# EAGLE design Qwiic Joystick (EAGLE 9.1.0)
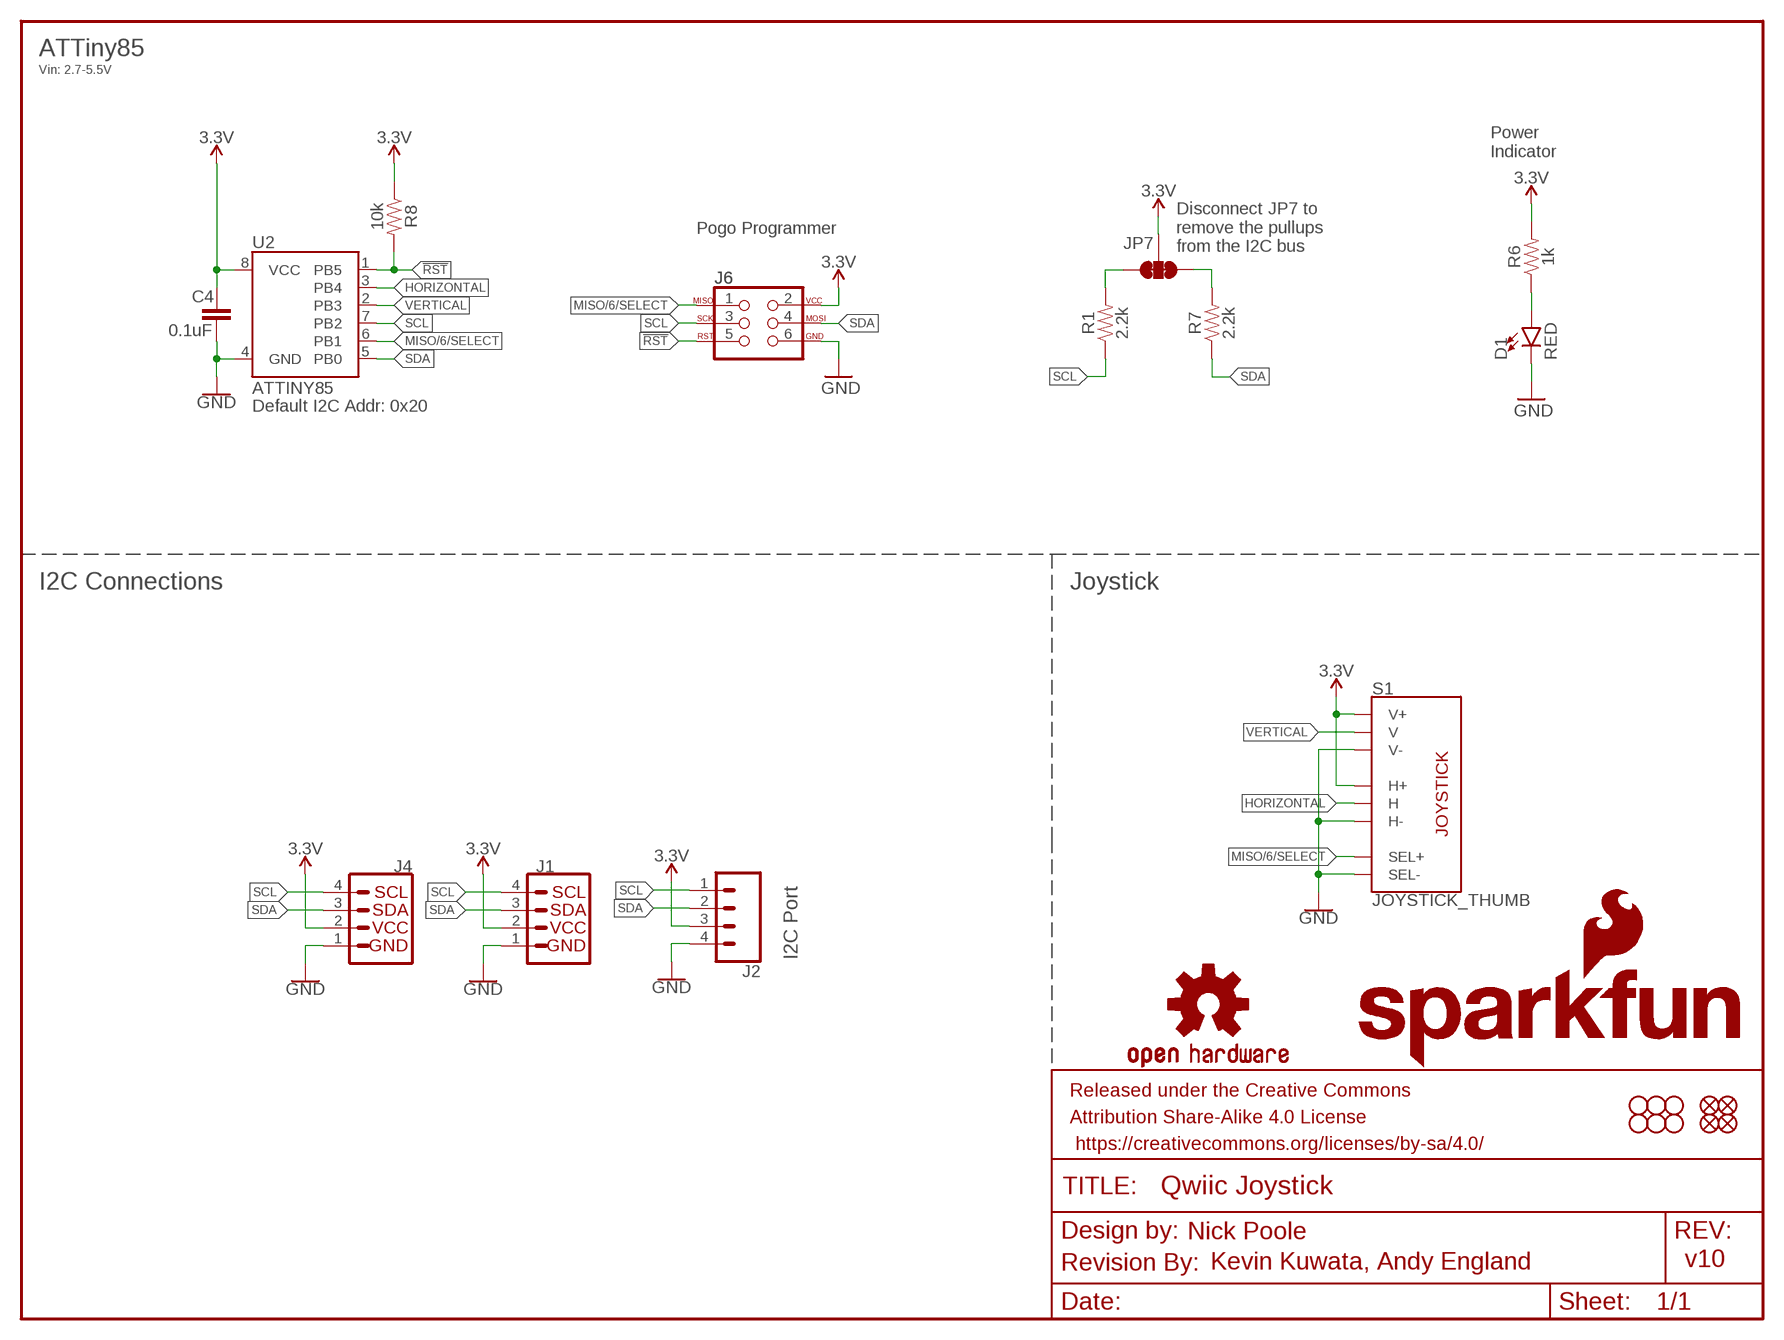
[diagram p0: schematic, sheet 1]

## Parts
C4  0.1uF  0.1UF-0603-25V-(+80/-20%)  [0603]
D1  RED  LED-RED0603  [LED-0603]
FRAME1  FRAME-LETTER  [CREATIVE_COMMONS]
H1  STAND-OFF  [STAND-OFF]
H2  STAND-OFF  [STAND-OFF]
H3  STAND-OFF  [STAND-OFF]
H4  STAND-OFF  [STAND-OFF]
H5  STAND-OFF  [STAND-OFF]
H6  STAND-OFF  [STAND-OFF]
J1  QWIIC_CONNECTORJS-1MM  [1X04_1MM_RA]
J2  CONN_041X04_NO_SILK  [1X04_NO_SILK]
J4  QWIIC_CONNECTORJS-1MM  [1X04_1MM_RA]
J6  AVR_SPI_PROG_3X2TESTPOINTS  [2X3_TEST_POINTS]
JP1  FIDUCIALUFIDUCIAL  [MICRO-FIDUCIAL]
JP2  FIDUCIALUFIDUCIAL  [MICRO-FIDUCIAL]
JP3  FIDUCIALUFIDUCIAL  [MICRO-FIDUCIAL]
JP6  FIDUCIALUFIDUCIAL  [MICRO-FIDUCIAL]
JP7  JUMPER-SMT_3_2-NC_TRACE_NO-SILK  [SMT-JUMPER_3_2-NC_TRACE_NO-SILK]
LOGO1  OSHW-LOGOMINI  [OSHW-LOGO-MINI]
LOGO2  REVISION  [REVISION]
R1  2.2k  2.2KOHM-0603-1/10W-1%  [0603]
R6  1k  1KOHM-0603-1/10W-1%  [0603]
R7  2.2k  2.2KOHM-0603-1/10W-1%  [0603]
R8  10k  10KOHM-0603-1/10W-1%  [0603]
S1  JOYSTICK_THUMB  [JOYSTICK]
U2  ATTINY85  [ATTINY85]
U$1  SFE_LOGO_NAME_FLAME.1_INCH  [SFE_LOGO_NAME_FLAME_.1]
U$2  SFE_LOGO_NAME_FLAME.1_INCH  [SFE_LOGO_NAME_FLAME_.1]

## Nets
3.3V: C4.1 J1.2 J2.3 J4.2 J6.2 JP7.2 R6.2 R8.1 S1.H1(H+) S1.V1(V+) U2.8(VCC)
!RST: J6.5 R8.2 U2.1(PB5)
GND: C4.2 D1.C J1.1 J2.4 J4.1 J6.6 S1.B2A(SEL-) S1.H3(H-) S1.V3(V-) U2.4(GND)
HORIZONTAL: S1.H2(H) U2.3(PB4)
MISO/6/SELECT: J6.1 S1.B1A(SEL+) U2.6(PB1)
N$1: D1.A R6.1
N$2: JP7.1 R7.2
N$3: JP7.3 R1.2
SCL: J1.4 J2.1 J4.4 J6.3 R1.1 U2.7(PB2)
SDA: J1.3 J2.2 J4.3 J6.4 R7.1 U2.5(PB0)
VERTICAL: S1.V2(V) U2.2(PB3)

## Notes on the sheet
- ATTiny85
- Vin: 2.7-5.5V
- Power
  Indicator
- Pogo Programmer
- Disconnect JP7 to 
  remove the pullups 
  from the I2C bus
- Default I2C Addr: 0x20
- I2C Connections | Joystick
- I2C Port
- Nick Poole
- Kevin Kuwata, Andy England | v10

## Library data of the parts
C4 = SparkFun-Capacitors:0.1UF: 0.1µF ceramic capacitors A capacitor is a passive two-terminal electrical component used to store electrical energy temporarily in an electric field.; PROD_ID: CAP-00810
D1 = SparkFun-LED:LED-RED: Red SMD LED Used in manufacturing of most products at SparkFun Packages: 0603 - SMD 0603 package [Product Link] <http://docs.avagotech.com/docs/AV02-0551EN> 0603 SMART - SMD 0603 SMART package ( more efficient and expensive)[Product Link] <http://www.osram-os.com/Graphics/XPic2/00077099_0.pdf> 1206 - SMD1206 package [Product Link] <https://www.sparkfun.com/datasheets/DevTools/LilyPad/Q150OVS4.pdff> SparkFun Products: Pro Mini 328 -5V <https://www.sparkfun.com/products/821> RedBoard <https://www.sparkfun.com/products/12757> IOIO-OTG <https://www.sparkfun.com/products/13613>; PROD_ID: DIO-00819
FRAME1 = SparkFun-Aesthetics:FRAME-LETTER: Schematic Frame - Letter Standard 8.5x11 US Letter frame
H1-H6 = SparkFun-Hardware:STAND-OFF: Stand Off Drill holes for mechanically mounting via screws, standoffs, etc. Note: Use the keepout ring to avoid running the screw head into surrounding components. Variant Overviews STAND-OFF - Mechanical footprint for a #4 phillips button head screw. STAND-OFF-TIGHT - Mechanical footprint for a #4 phillips button head screw, Example SparkFun Products Screw - Phillips Head (1/4", 4-40, 10 pack) <https://www.sparkfun.com/products/10453> (PRT-10453) Screw - Phillips Head (1/2", 4-40, 10 pack) <https://www.sparkfun.com/products/10452> (PRT-10452) Screw - Phillips Head (3/4", 4-40, 10 pack) <https://www.sparkfun.com/products/10451> (PRT-10451) Screw - Phillips Head (1", 4-40, 10 pack) <https://www.sparkfun.com/products/10450> (PRT-10450)
J1 J4 = SparkFun-Connectors:QWIIC_CONNECTOR: SparkFun I2C Standard Qwiic Connector An SMD 1mm pitch JST connector makes it easy and quick (get it? Qwiic?) to connect I2C devices to each other. The Qwiic system <http://www.sparkfun.com/qwiic> enables fast and solderless connection between popular platforms and various sensors and actuators. We carry 200mm <https://www.sparkfun.com/products/14204>, 100mm <https://www.sparkfun.com/products/14205>, 50mm <https://www.sparkfun.com/products/14206>, and breadboard friendly <https://www.sparkfun.com/products/14207> Qwiic cables. We also offer 10 pcs strips <https://www.sparkfun.com/products/14323> the SMD connectors.; PROD_ID: CONN-13694
J2 = SparkFun-Connectors:CONN_04: Multi connection point. Often used as Generic Header-pin footprint for 0.1 inch spaced/style header connections On any of the 0.1 inch spaced packages, you can populate with these: Break Away Headers - Straight <https://www.sparkfun.com/products/116> (PRT-00116) Break Away Male Headers - Right Angle <https://www.sparkfun.com/products/553> (PRT-00553) Female Headers <https://www.sparkfun.com/products/115> (PRT-00115) Break Away Headers - Machine Pin <https://www.sparkfun.com/products/117> (PRT-00117) Break Away Female Headers - Swiss Machine Pin <https://www.sparkfun.com/products/743> (PRT-00743) For SCREWTERMINALS and SPRING TERMINALS visit here: Screw Terimnals on SparkFun.com <https://www.sparkfun.com/search/results?term=Screw+Terminals> (5mm/3.5mm/2.54mm spacing) This device is also useful as a general connection point to wire up your design to another part of your project. Our various solder wires solder well into these plated through hole pads. Hook-Up Wire - Assortment (Stranded, 22 AWG) <https://www.sparkfun.com/products/11375> (PRT-11375) Hook-Up Wire - Assortment (Solid Core, 22 AWG) <https://www.sparkfun.com/products/11367> (PRT-11367) View the entire wire category on our website here <https://www.sparkfun.com/categories/141> Special notes: Molex polarized connector foot print use with SKU : PRT-08231 with associated crimp pins and housings. 1MM SMD Version SKU: PRT-10208; PROD_ID: CONN-09696
J6 = SparkFun-Connectors:AVR_SPI_PROG_3X2: AVR ISP 6 Pin This is the reduced ISP connector for AVR programming. Common on Arduino. This footprint will take up less PCB space and can be used with a 10-pin to 6-pin adapter such as SKU: BOB-08508 **Special note about "TEST_POINT" package. The stop mask is on the top side, so if you want your programming test points to be on the bottom of your board, make sure to place this package on the bottom side of the board. This also ensure that the orientation to program from the bottom side will be correct. SparkFun Products: SparkFun ISP Pogo Adapter <https://www.sparkfun.com/products/11591> - NS Tiny AVR Programmer <https://www.sparkfun.com/products/11801> -PTH
JP1-JP3 JP6 = SparkFun:FIDUCIAL: Fiducial Alignment Points Various fiducial points for machine vision alignment.
JP7 = SparkFun-Jumpers:JUMPER-SMT_3_2-NC_TRACE: Normally closed trace jumper (2 of 2 connections) This jumper has a trace between all three pads so they are normally closed (NC). Use a razor knife to open the connection(s). For best results follow the IPC guidelines for cutting traces: Cutout at least 0.063 mm (0.005 in). Remove all loose material to clean up the cut area. Seal the cut with an approved epoxy. Reapply solder to reclose the connection(s).
LOGO1 = SparkFun-Aesthetics:OSHW-LOGO: Open-Source Hardware (OSHW) Logo This logo indicates the piece of hardware it is found on incorporates a OSHW license and/or adheres to the definition of open source hardware found here: http://freedomdefined.org/OSHW
LOGO2 = SparkFun-Aesthetics:REVISION: "Revision By" Text Preceding text for revisor documentation. Includes schematic text on "symbols" layer, and board text on tDoc.
R1 R7 = SparkFun-Resistors:2.2KOHM: 2.2kΩ resistor A resistor is a passive two-terminal electrical component that implements electrical resistance as a circuit element. Resistors act to reduce current flow, and, at the same time, act to lower voltage levels within circuits. - Wikipedia; PROD_ID: RES-08272
R6 = SparkFun-Resistors:1KOHM: 1kΩ resistor A resistor is a passive two-terminal electrical component that implements electrical resistance as a circuit element. Resistors act to reduce current flow, and, at the same time, act to lower voltage levels within circuits. - Wikipedia; PROD_ID: RES-07856
R8 = SparkFun-Resistors:10KOHM: 10kΩ resistor A resistor is a passive two-terminal electrical component that implements electrical resistance as a circuit element. Resistors act to reduce current flow, and, at the same time, act to lower voltage levels within circuits. - Wikipedia; PROD_ID: RES-00824
S1 = SparkFun-Switches:JOYSTICK_THUMB: Analog Thumb Joystick This is a joystick very similar to the ‘analog’ joysticks on PS2 (PlayStation 2) controllers. Directional movements are simply two potentiometers - one for each axis. Pots are ~10k each. This joystick also has a select button that is actuated when the joystick is pressed down. SparkFun Products Thumb Joystick <https://www.sparkfun.com/products/9032> (COM-09032) SparkFun Thumb Joystick Breakout <https://www.sparkfun.com/products/9110> (BOB-09110) SparkFun Joystick Shield Kit <https://www.sparkfun.com/products/9760> (DEV-09760); PROD_ID: COMP-09744; SF_SKU: COM-09032
U2 = SparkFun-IC-Microcontroller:ATTINY85; PROD_ID: IC-09092
U$1 U$2 = SparkFun-Aesthetics:SFE_LOGO_NAME_FLAME: SparkFun Font Logo w/ Flame This is the SparkFun full logo. The logo on the schematic will always be the same size; the package variant is the height of the flame part of the logo. Default layer for the logo on the board is tSilk.

## Board
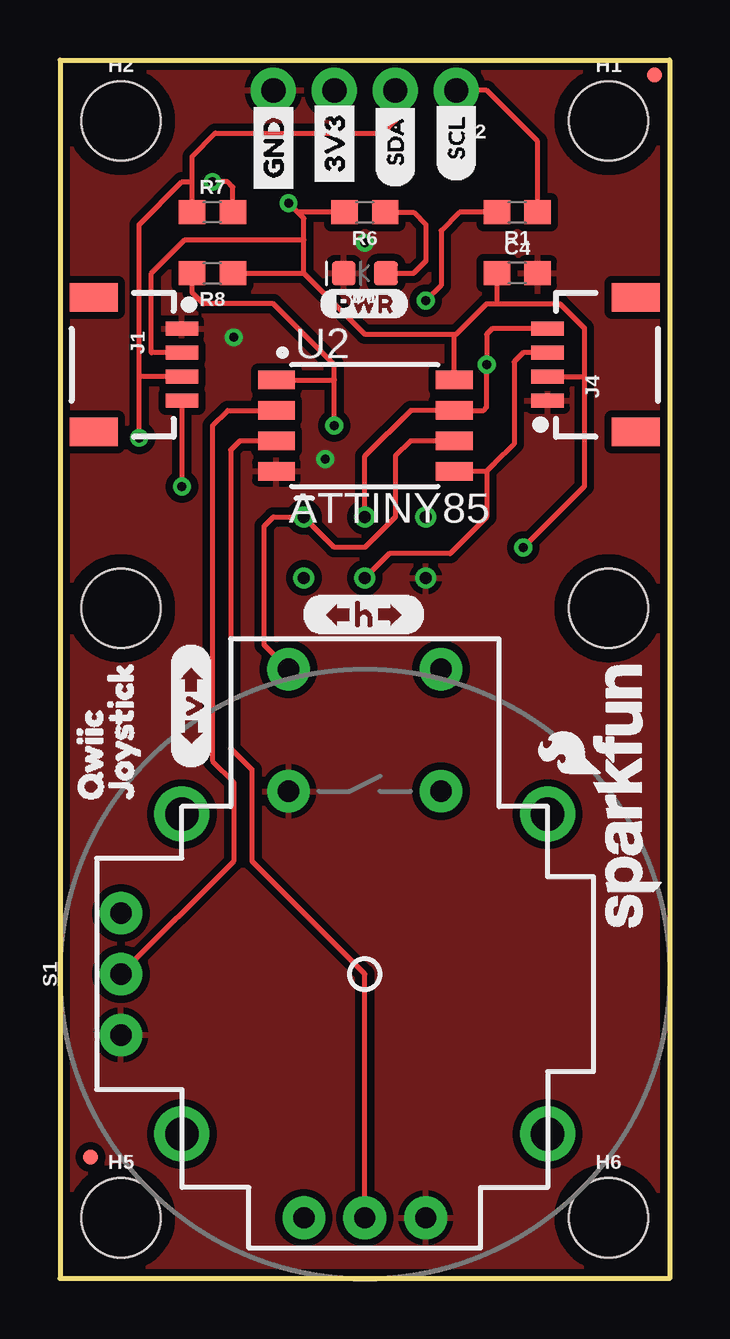
[diagram p1: board, top side]
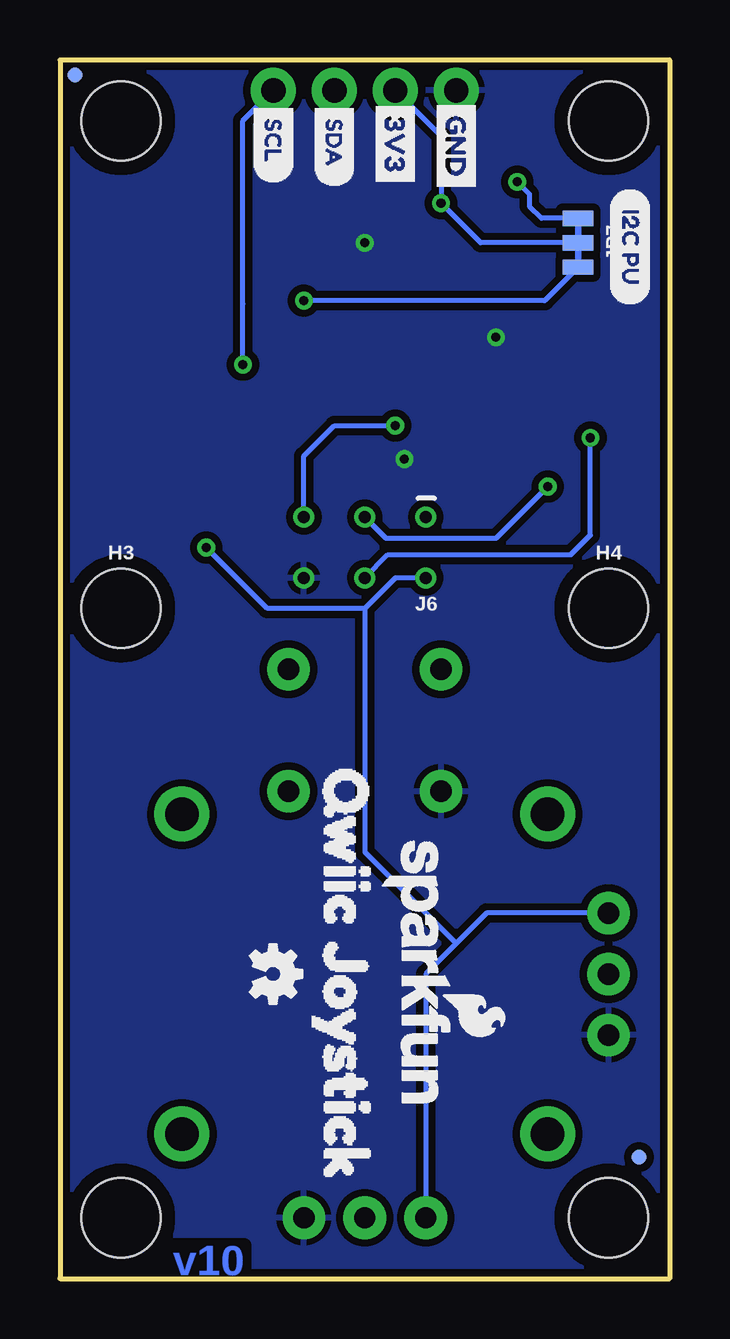
[diagram p2: board, bottom side, seen from below]

Size 25.4 x 50.8 mm. Coordinates in mm from the lower left corner, seen from the top.
Outline: 0,50.8 0,0 25.4,0 25.4,50.8 0,50.8
Copper layers (1*16): Top 0.035mm / dielectric 1.5mm / Bottom 0.035mm
Design rules "SparkFun-2-layer-TIGHT": minimum track width 7mil, minimum drill 15mil, track to track 7mil, track to pad 7mil, pad to pad 7mil, via to via 7mil, smd to smd 7mil, copper to edge 7mil, drill to drill 7mil, minimum pad ring 7mil, minimum via ring 7mil, stop-mask expansion 4mil, vias tented up to drill 25mil, thermal gap 10mil

### Footprints (pad centres in the part's own frame; a part is rotated, then mirrored left to right if it is on the bottom)
0603 = smd 1.1 x 1: 1 -0.85,0; 2 0.85,0
LED-0603 = smd 1 x 1: A -0.877,0; C 0.877,0
STAND-OFF = hole 3.302: 0,0
1X04_1MM_RA = smd 0.6 x 1.35: 1 -1.5,0; 2 -0.5,0; 3 0.5,0; 4 1.5,0 | smd 1.2 x 2: NC1 2.8,-3.675; NC2 -2.8,-3.675
1X04_NO_SILK = drill 1.016 pad 1.88: 1 0,0; 2 2.54,0; 3 5.08,0; 4 7.62,0
2X3_TEST_POINTS = drill 0.508: 1 -2.54,-1.27; 2 -2.54,1.27; 3 0,-1.27; 4 0,1.27; 5 2.54,-1.27; 6 2.54,1.27
MICRO-FIDUCIAL = smd 0.635 x 0.635: 1 0,0
SMT-JUMPER_3_2-NC_TRACE_NO-SILK = smd 0.635 x 1.27: 1 -1.016,0; 2 0,0; 3 1.016,0
JOYSTICK = drill 0.9 pad 1.778: B1A -3.175,12.7; B1B 3.175,12.7; B2A -3.175,7.62; B2B 3.175,7.62 | drill 0.889 pad 1.778: H1 -2.54,-10.16; H2 0,-10.16; H3 2.54,-10.16; V1 -10.16,2.54; V2 -10.16,0; V3 -10.16,-2.54 | drill 1.397 pad 2.286: MOUNT1 -7.62,6.668; MOUNT2 -7.62,-6.668; MOUNT3 7.62,-6.668; MOUNT4 7.62,6.668
ATTINY85 = smd 1.524 x 0.762: 1 -3.683,1.905; 2 -3.683,0.635; 3 -3.683,-0.635; 4 -3.683,-1.905; 5 3.727,-1.905; 6 3.727,-0.635; 7 3.727,0.635; 8 3.727,1.905

### Placement (x,y rotation side)
C4  19.05,41.91 0 top
D1  12.7,41.91 180 top
FRAME1  -12.7,-12.7 0 top  (outside the outline)
H1  22.86,48.26 0 top
H2  2.54,48.26 0 top
H3  22.86,27.94 0 bottom
H4  2.54,27.94 0 bottom
H5  2.54,2.54 0 top
H6  22.86,2.54 0 top
J1  5.08,38.1 270 top
J2  16.51,49.53 180 top
J4  20.32,38.1 90 top
J6  12.7,30.48 180 bottom
JP1  24.77,50.16 270 top
JP2  1.27,5.08 0 top
JP3  1.27,5.08 270 bottom
JP6  24.77,50.16 270 bottom
JP7  3.81,43.18 270 bottom
LOGO1  16.51,12.7 270 bottom
LOGO2  -1.27,-15.24 0 top  (outside the outline)
R1  19.05,44.45 180 top
R6  12.7,44.45 180 top
R7  6.35,44.45 0 top
R8  6.35,41.91 180 top
S1  12.7,12.7 0 top
U2  12.7,35.56 0 top
U$1  10.54,12.7 270 bottom
U$2  23.62,20.19 90 top
U$3  [QWIIC0]  1.27,19.05 90 top
U$4  [I2C_PU0]  1.65,45.47 270 bottom
U$5  [SDA0]  13.97,49.28 270 bottom
U$6  [GND4]  8.89,44.96 90 top
U$7  [##V##1]  5.46,21.21 90 top
U$8  [GND4]  8.89,49.4 270 bottom
U$9  [SCL1]  16.51,49.28 270 bottom
U$10  [JOYSTICK0]  2.54,19.05 90 top
U$11  [SCL3]  16.51,45.72 90 top
U$12  [SDA2]  13.97,45.47 90 top
U$13  [QWIIC_JOYSTICK1]  13.46,22.86 270 bottom
U$14  [PWR-()-03]  10.79,40.64 0 top
U$15  [##H##0]  10.03,27.69 0 top
U$16  [3V35]  11.43,45.21 90 top
U$17  [3V35]  11.43,49.4 270 bottom

### Tracks (layer width: path | path; a pad name or v marks a point on that pad's centre or on a via)
3.3V  (via drill 0.38)
  Top 0.203: 21.84,37.59 21.84,39.62 20.83,40.64 18.2,40.64 | 21.84,37.59 21.84,35.05 21.84,33.02 v19.3,30.48 | R6.2 9.91,44.45 v9.53,44.83 10.16,44.2 10.16,43.31 | 10.16,41.91 12.7,39.37 16.43,39.37 | J1.2 3.81,38.6 3.81,41.91 5.21,43.31 10.16,43.31 | 10.16,41.91 10.16,43.31 | R8.1 10.16,41.91 | C4.1 18.2,40.64 | U2.8 16.43,39.37 | 16.43,39.37 16.51,39.37 17.78,40.64 18.2,40.64 | J4.2 21.84,37.6 21.84,37.59
  Bottom 0.203: S1.V1 7.62,15.24 8.89,13.97 | 8.89,13.97 10.16,12.7 S1.H1 | 8.89,13.97 12.7,17.78 12.7,27.94 | J6.2 11.43,29.21 12.7,27.94 | 12.7,27.94 16.76,27.94 v19.3,30.48 | JP7.2 7.87,43.18 v9.53,44.83 9.53,47.62 J2.3
!RST  (via drill 0.38)
  Top 0.203: v11.43,35.56 11.43,37.47 | 11.43,37.47 11.43,38.1 8.89,40.64 5.97,40.64 5.5,41.11 R8.2 | U2.1 11.43,37.47
  Bottom 0.203: J6.5 15.24,34.29 13.97,35.56 v11.43,35.56
GND  (via drill 0.38)
  other vias: 7.24,39.24 11.05,34.16 12.7,43.18
  pour Top (isolate 0.305): 0,0 25.4,0 25.4,50.8 0,50.8
  pour Bottom (isolate 0.305): 0,0 25.4,0 25.4,50.8 0,50.8
HORIZONTAL
  Top 0.203: S1.H2 12.7,12.7 8,17.4 8,21.21 7.11,22.1 7.11,34.54 7.49,34.92 U2.3
MISO/6/SELECT
  Top 0.203: S1.B1A 8.51,26.42 8.51,31.37 8.89,31.75 J6.1 11.43,30.48 12.7,30.48 13.97,31.75 13.97,34.29 14.61,34.92 U2.6
N$1
  Top 0.203: D1.A 14.73,41.91 15.24,42.42 15.24,43.94 14.73,44.45 R6.1
N$2  (via drill 0.38)
  Top 0.203: R7.2 7.2,45.51 6.99,45.72 v6.35,45.72
  Bottom 0.203: JP7.1 5.33,44.2 5.84,44.7 5.84,45.21 v6.35,45.72
N$3  (via drill 0.38)
  Top 0.203: R1.2 16.64,44.45 15.88,43.69 15.88,41.4 v15.24,40.77
  Bottom 0.203: JP7.3 5.21,40.77 v15.24,40.77
SCL  (via drill 0.38)
  Top 0.203: J2.1 17.78,49.53 19.9,47.41 R1.1 | J1.4 v5.08,33.02 | J6.3 12.7,34.29 14.61,36.2 U2.7 17.65,36.2 17.78,36.32 v17.78,38.1 17.78,39.37 18.01,39.6 J4.4
  Bottom 0.203: v5.08,33.02 7.24,30.86 11.81,30.86 J6.3 | v17.78,38.1 17.78,40.64 17.78,48.26 J2.1
SDA  (via drill 0.38)
  Top 0.203: J2.2 13.97,48.26 13.46,47.75 6.48,47.75 5.5,46.77 5.5,45.72 | R7.1 5.5,45.72 | 5.5,45.72 5.08,45.72 3.3,43.94 3.3,37.59 | J6.4 13.72,30.23 16.26,30.23 17.78,31.75 17.78,33.66 | U2.5 17.78,33.66 | 17.78,33.66 18.1,33.97 18.92,34.8 18.92,38.23 19.3,38.6 J4.3 | v3.3,35.05 3.3,37.59 | 3.3,37.59 3.31,37.6 J1.3
  Bottom 0.203: J6.4 11.73,30.18 4.12,30.18 3.3,30.99 v3.3,35.05
VERTICAL
  Top 0.203: S1.V2 7.24,17.4 7.24,20.7 6.35,21.59 6.35,35.56 6.99,36.2 U2.2

### Text on the board
Bottom: v10
tDocu: Nick Poole | Kevin Kuwata, Andy England